# Altium schematic sheet HEATER and DRIVER.SchDoc
size A3; SheetNumber: 2; SheetTotal: 7
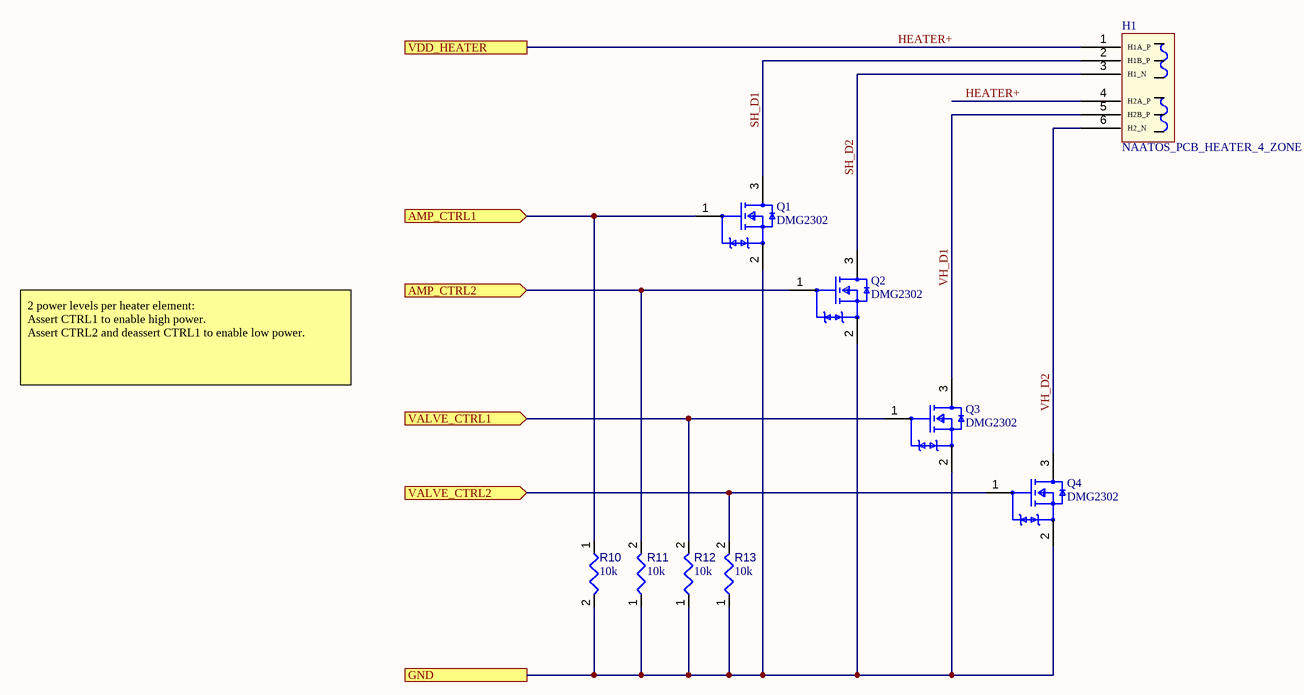
[diagram p0: HEATER and DRIVER.SchDoc]

## Parts
H1  NAATOS_PCB_HEATER_4_ZONE  [REV9-1]  (net tie, no BOM)
Q1  DMG2302  [FP-SOT23-MFG]
Q2  DMG2302  [FP-SOT23-MFG]
Q3  DMG2302  [FP-SOT23-MFG]
Q4  DMG2302  [FP-SOT23-MFG]
R10  value 10k  [RESC0402(1005)_L]  (hidden comment: Resistor 10K  +/-1 % 0402 63 mW)
R11  value 10k  [RESC0402(1005)_L]  (hidden comment: Resistor 10K  +/-1 % 0402 63 mW)
R12  value 10k  [RESC0402(1005)_L]  (hidden comment: Resistor 10K  +/-1 % 0402 63 mW)
R13  value 10k  [RESC0402(1005)_L]  (hidden comment: Resistor 10K  +/-1 % 0402 63 mW)

## Ports
AMP_CTRL1 (in), AMP_CTRL2 (in), GND, VALVE_CTRL1 (in), VALVE_CTRL2 (in), VDD_HEATER

## Nets
AMP_CTRL1: Q1.1(G) R10.1 ; port AMP_CTRL1
AMP_CTRL2: Q2.1(G) R11.2 ; port AMP_CTRL2
GND: Q1.2(S) Q2.2(S) Q3.2(S) Q4.2(S) R10.2 R11.1 R12.1 R13.1 ; port GND
HEATER+: H1.1(H1A_P) H1.4(H2A_P) ; port VDD_HEATER
SH_D1: H1.2(H1B_P) Q1.3(D)
SH_D2: H1.3(H1_N) Q2.3(D)
VALVE_CTRL1: Q3.1(G) R12.2 ; port VALVE_CTRL1
VALVE_CTRL2: Q4.1(G) R13.2 ; port VALVE_CTRL2
VH_D1: H1.5(H2B_P) Q3.3(D)
VH_D2: H1.6(H2_N) Q4.3(D)

## Notes on the sheet
- 2 power levels per heater element:
  Assert CTRL1 to enable high power.
  Assert CTRL2 and deassert CTRL1 to enable low power.
- Sheet Title
- PCB Project Name
- Modified
- Sheet
- of

## Library data of the parts
H1 = CMP-448-000000-8: Source: NAATOS_PCB_HEATER_4ELEMENT.SchLib; Design Item ID: NAATOS_PCB_HEATERS
Q1-Q4 = CMP-013-00036-2: Small Signal Field-Effect Transistor, 2.8A I(D), 20V, 1-Element, N-Channel, Silicon, Metal-oxide Semiconductor FET; Manufacturing Lifecycle 1: Unknown; Manufacturer 1: HXY Mosfet; Manufacturer Part Number 1: DMG2302U-HXY; Vgs (Max): 12V; Supplier Unit Price 1: .009; Supplier Part Number 1: C22367244; Min Operating Temperature: -55°C; Max Operating Temperature: 150°C; Case/Package: SOT-23; RoHS Compliant: Yes; Supplier 1: LCSC; Pins: 3; ComponentLink1URL: https://www.lcsc.com/product-detail/MOSFETs_HXY-MOSFET-DMG2302U-HXY_C22367244.html?s_z=n_DMG2302
R10-R13 = CMP-009-00149-2: Chip Resistor, 10 kOhms, +/-1 %, 63 mW, -55 to 125 degC, 0402; Power: 63mW; Tolerance: 1%; Pins: 2; Max Operating Temperature: 155°C; Min Operating Temperature: -55°C; Case/Package: 0402